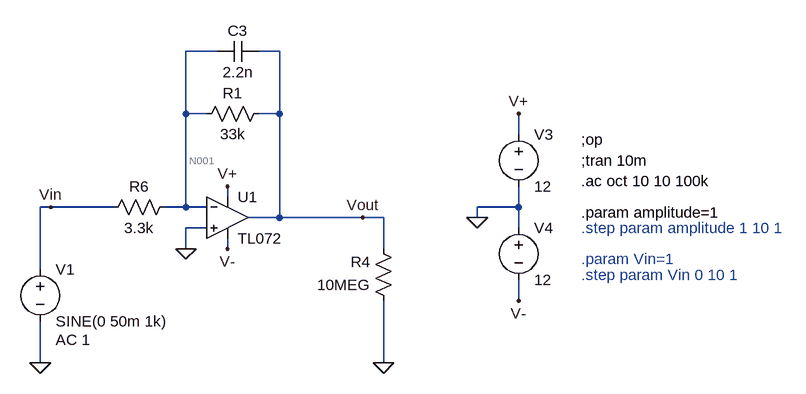
[diagram p0: schematic lpf.asc]
* lpf.asc
R4 0 Vout 10MEG
V1 Vin 0 SINE(0 50m 1k) AC 1
* U1: TL072 (symbol TL072 National\TL072 not available, pins judged from their places): In+=0 In-=N001 V+=V+ V-=V- OUT=Vout
V3 V+ 0 12
V4 0 V- 12
C3 Vout N001 2.2n
R1 N001 Vout 33k
R6 Vin N001 3.3k
;op
* .step param amplitude 1 10 1
;tran 10m
.param amplitude=1
* .step param Vin 0 10 1
* .param Vin=1
.ac oct 10 10 100k
.backanno
.end

* Results of the author's LTspice run, read from the files saved beside the schematic
* Operating Point, zero values left out:
*   V(vout) = 122.1 µV
*   V(v-) = -12 V
*   V(v+) = 12 V
*   V(n001) = 10.97 µV
*   I(R6) = -3.324 nA
*   I(R1) = -3.366 nA
*   I(R4) = -12.21 pA
*   I(V4) = -11.39 mA
*   I(V3) = -11.39 mA
*   I(V1) = 3.324 nA
*   Ix(u1:1) = 42.05 pA
*   Ix(u1:2) = 42.05 pA
*   Ix(u1:3) = 11.39 mA
*   Ix(u1:4) = -11.39 mA
*   Ix(u1:5) = -3.379 nA
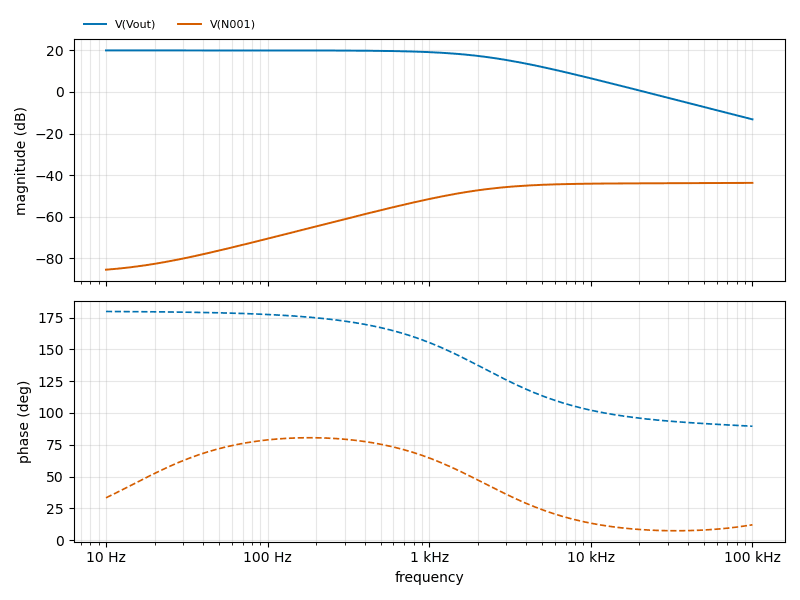
[diagram p1: AC Analysis of lpf.asc, plotted from the saved traces]
* AC Analysis, 1 run:
*   V(Vout): 20.00 dB at 10 Hz, -13.19 dB at 100 kHz, peak 20.00 dB at 10 Hz, 3 dB below the peak at 2.177 kHz
*   V(N001): -85.55 dB at 10 Hz, -43.77 dB at 100 kHz, peak -43.77 dB at 100 kHz, 3 dB below the peak at 2.274 kHz